# Altium schematic sheet sepic_schem.SchDoc
size A; SheetNumber: 1; SheetTotal: 2
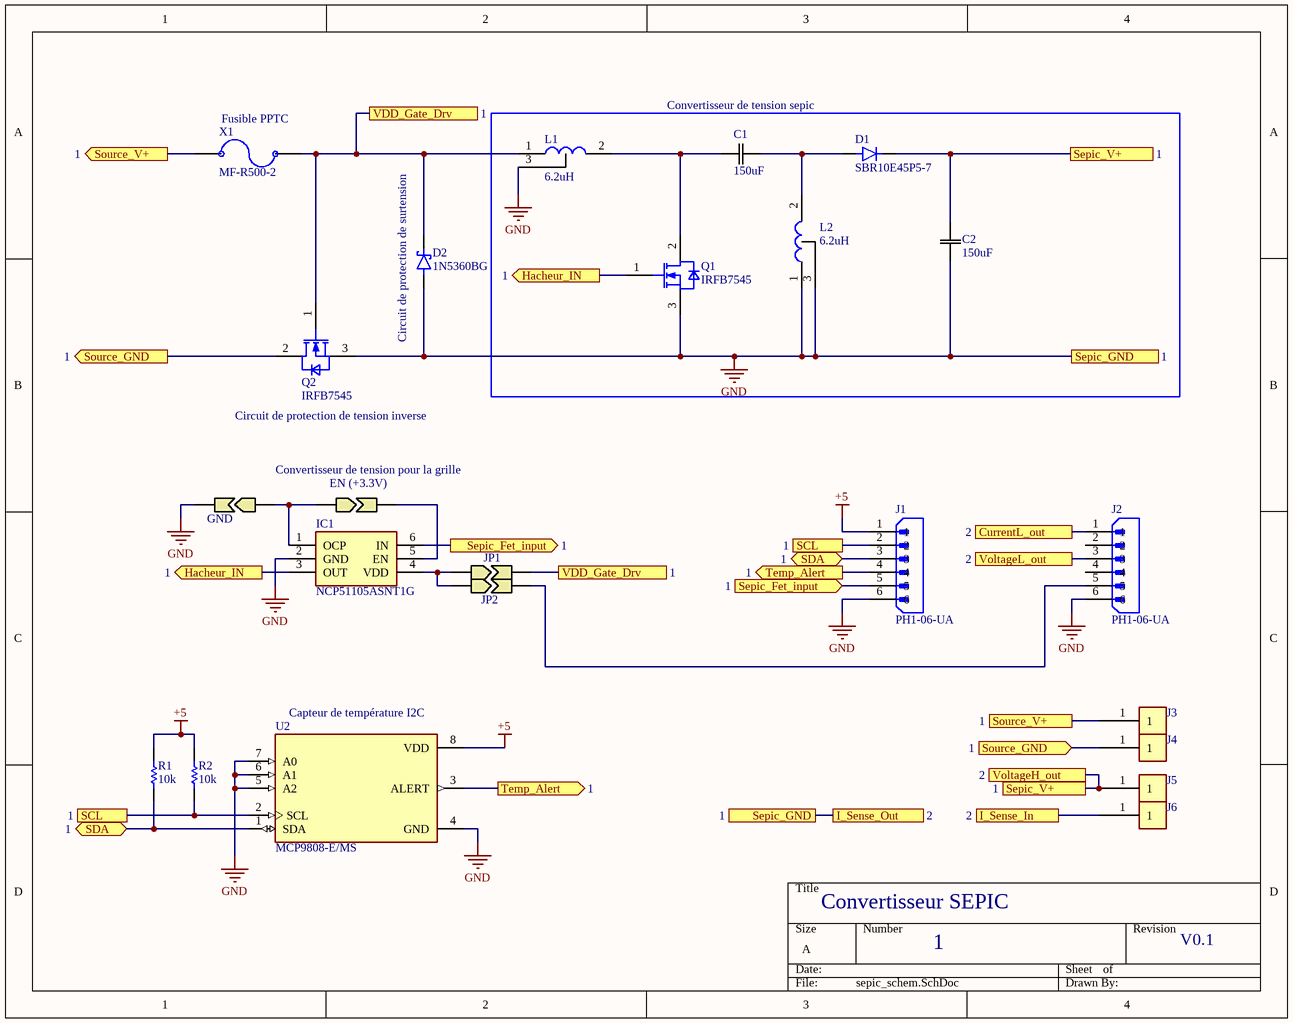
[diagram p0: sepic_schem.SchDoc]

## Parts
C1  150uF  [CAP_A768_KEM]
C2  150uF  [CAP_A768_KEM]
D1  SBR10E45P5-7  [SBR10E45P5-7]
D2  1N5360BG  [DIOAD1543W101L863D368]
EN_(+3.3V)  Solder Bridge  [Bridge1mmX2mm]  (value not drawn)  (no BOM)
GND  Solder Bridge  [Bridge1mmX2mm]  (value not drawn)  (no BOM)
IC1  NCP51105ASNT1G  [SOP95P275X110-6N]
J1  PH1-06-UA  [ADAMTECH_PH1-06-UA]
J2  PH1-06-UA  [ADAMTECH_PH1-06-UA]
J3  BananaConnector  [banana_connector]  (value not drawn)
J4  BananaConnector  [banana_connector]  (value not drawn)
J5  BananaConnector  [banana_connector]  (value not drawn)
J6  BananaConnector  [banana_connector]  (value not drawn)
JP1  Solder Bridge  [Bridge1mmX2mm]  (value not drawn)  (no BOM)
JP2  Solder Bridge  [Bridge1mmX2mm]  (value not drawn)  (no BOM)
L1  6.2uH  [CDEP147NP6R1MC125]
L2  6.2uH  [CDEP147NP6R1MC125]
Q1  IRFB7545  [IFX-PG-TO220-3-904]
Q2  IRFB7545  [IFX-PG-TO220-3-904]
R1  value 10k  [AXIAL-0.3]  (hidden comment: Res1)
R2  value 10k  [AXIAL-0.3]  (hidden comment: Res1)
U2  MCP9808-E/MS  [SOP65P490X110-8N]
X1  MF-R500-2  [MF-R500-2]

## Blocks framed on the sheet
Convertisseur de tension sepic: C1 C2 D1 L1 L2 Q1

## Ports
CurrentL_out (see 2), Hacheur_IN (out, see 1), I_Sense_In (see 2), I_Sense_Out (see 2), SCL (see 1), SDA (bidir, see 1), Sepic_Fet_input (in, see 1), Sepic_Fet_input (out, see 1), Sepic_GND (see 1), Sepic_V+ (see 1), Source_GND (in, see 1), Source_GND (out, see 1), Source_V+ (out, see 1), Source_V+ (see 1), Temp_Alert (out, see 1), VDD_Gate_Drv (see 1), VoltageH_out (see 2), VoltageL_out (see 2)

## Nets
+5: J1.1 R1.2 R2.2 U2.8(VDD)
GND: C2.1 D2.2(A) GND.2 IC1.2(GND) J1.6 J2.6 L1.3 L2.1 L2.3 Q1.3(SOURCE) Q2.3(SOURCE) U2.4(GND) U2.5(A2) U2.6(A1) U2.7(A0) ; port Sepic_GND, port I_Sense_Out
CurrentL_out: J2.1 ; port CurrentL_out
Hacheur_IN: IC1.3(OUT) Q1.1(GATE) ; port Hacheur_IN
I_Sense_In: J6.1 ; port I_Sense_In
SCL: J1.2 R2.1 U2.2(SCL) ; port SCL
SDA: J1.3 R1.1 U2.1(SDA) ; port SDA
Sepic_Fet_input: IC1.6(IN) J1.5 ; port Sepic_Fet_input
Sepic_V+: C2.2 D1.2(K) J5.1 ; port Sepic_V+, port VoltageH_out
Source_GND: J4.1 Q2.2(DRAIN) ; port Source_GND
Source_V+: J3.1 X1.1 ; port Source_V+
Temp_Alert: J1.4 U2.3(ALERT) ; port Temp_Alert
VDD_Gate_Drv: D2.1(K) JP1.2 L1.1 Q2.1(GATE) X1.2 ; port VDD_Gate_Drv
VoltageL_out: J2.3 ; port VoltageL_out
NetC1_1: C1.1 L1.2 Q1.2(DRAIN)
NetC1_2: C1.2 D1.1(A) L2.2
NetEN_(+3.3V)_1: EN_(+3.3V).1 GND.1 IC1.1(OCP)
NetEN_(+3.3V)_2: EN_(+3.3V).2 IC1.5(EN)
NetIC1_4: IC1.4(VDD) JP1.1 JP2.1
NetJ2_5: J2.5 JP2.2

Not connected (* = marked no-connect by the designer): J2 2 4

## Notes on the sheet
- (near X1) Fusible PPTC
- (near D2) Circuit de protection de surtension
- Circuit de protection de tension inverse
- Convertisseur de tension pour la grille
- (near U2) Capteur de température I2C
- Convertisseur SEPIC
- V0.1

## Library data of the parts
C1 C2 = A768KS157M1GLAS025: No Description Available; Manufacturer_Name: Kemet; Copyright: Copyright (C) 2025 Ultra Librarian. All rights reserved.; Manufacturer_Part_Number: A768KS157M1GLAS025
D1 = SBR10E45P5-7: SBR10E45P5-7, low Vf 5W 10A; MF: {'manufacturer': u'onsemi'}; MP: 1N5360BG; Package: None; Price: None; Value: *; Availability: Unavailable
D2 = 1N5360BG: MF: {'manufacturer': u'onsemi'}; Package: None; Price: None; Value: *; MP: 1N5360BG; Availability: Unavailable
IC1 = NCP51105ASNT1G: Integrated Circuit; Manufacturer_Name: onsemi; Datasheet Link: https://www.onsemi.com/pub/Collateral/NCP51105-D.PDF; Height: 1.1mm; Manufacturer_Part_Number: NCP51105ASNT1G
J1 J2 = PH1-06-UA: Pin Header 6P .100 Pitch Plug | Adam Tech PH1-06-UA; SnapEDA_Link: https://www.snapeda.com/parts/PH1-06-UA/Adam+Tech/view-part/?ref=snap; Package: None; Value: *; MF: Adam Tech; MP: PH1-06-UA; Check_prices: https://www.snapeda.com/parts/PH1-06-UA/Adam+Tech/view-part/?ref=eda
L1 L2 = CDEP147NP-6R1MC-125: Inductor; Manufacturer_Name: Sumida; Datasheet Link: https://products.sumida.com/products/pdf/CDEP147.pdf; Height: 0.8mm; Manufacturer_Part_Number: CDEP147NP-6R1MC-125; Mouser Part Number: 851-CDEP147P6R1MC125; Mouser Price/Stock: https://www.mouser.co.uk/ProductDetail/Sumida/CDEP147NP-6R1MC-125?qs=ttApTud31JaFBwCTy16d0g%3D%3D; Arrow Part Number: CDEP147NP-6R1MC-125; Arrow Price/Stock: https://www.arrow.com/en/products/cdep147np-6r1mc-125/sumida?utm_currency=USD&region=nac
Q1 Q2 = IRFB7545: Insulated-Gate Field-Effect Transistor (IGFET), N-Channel, Enhancement, Body Diode, Pin 1 Gate, 2 Drain, 3 Source, 3 Pins; Manufacturer: Infineon Technologies; Manufacturer Order Number: IRFB7545; PackageReference: PG-TO220-3-904
R1 R2 = Res1: Resistor; Published: 8-Jun-2000; LatestRevisionDate: 17-Jul-2002; LatestRevisionNote: Re-released for DXP Platform.; PackageReference: AXIAL-0.3; Publisher: Altium Limited; PackageDescription: Axial Device, Thru-Hole; 2 Leads; 0.3 in Pin Spacing
U2 = MCP9808-E/MS: Microchip MCP9808-E/MS Temperature Sensor 8-Pin MSOP, -40 - +125 degC | Microchip Technology Inc. MCP9808-E/MS; SnapEDA_Link: https://www.snapeda.com/parts/MCP9808-E/MS/Microchip/view-part/?ref=snap; Package: MSOP-8 Microchip; Value: *; MF: Microchip; MP: MCP9808-E/MS; Check_prices: https://www.snapeda.com/parts/MCP9808-E/MS/Microchip/view-part/?ref=eda